# EAGLE schematic Switch (EAGLE 6.1)
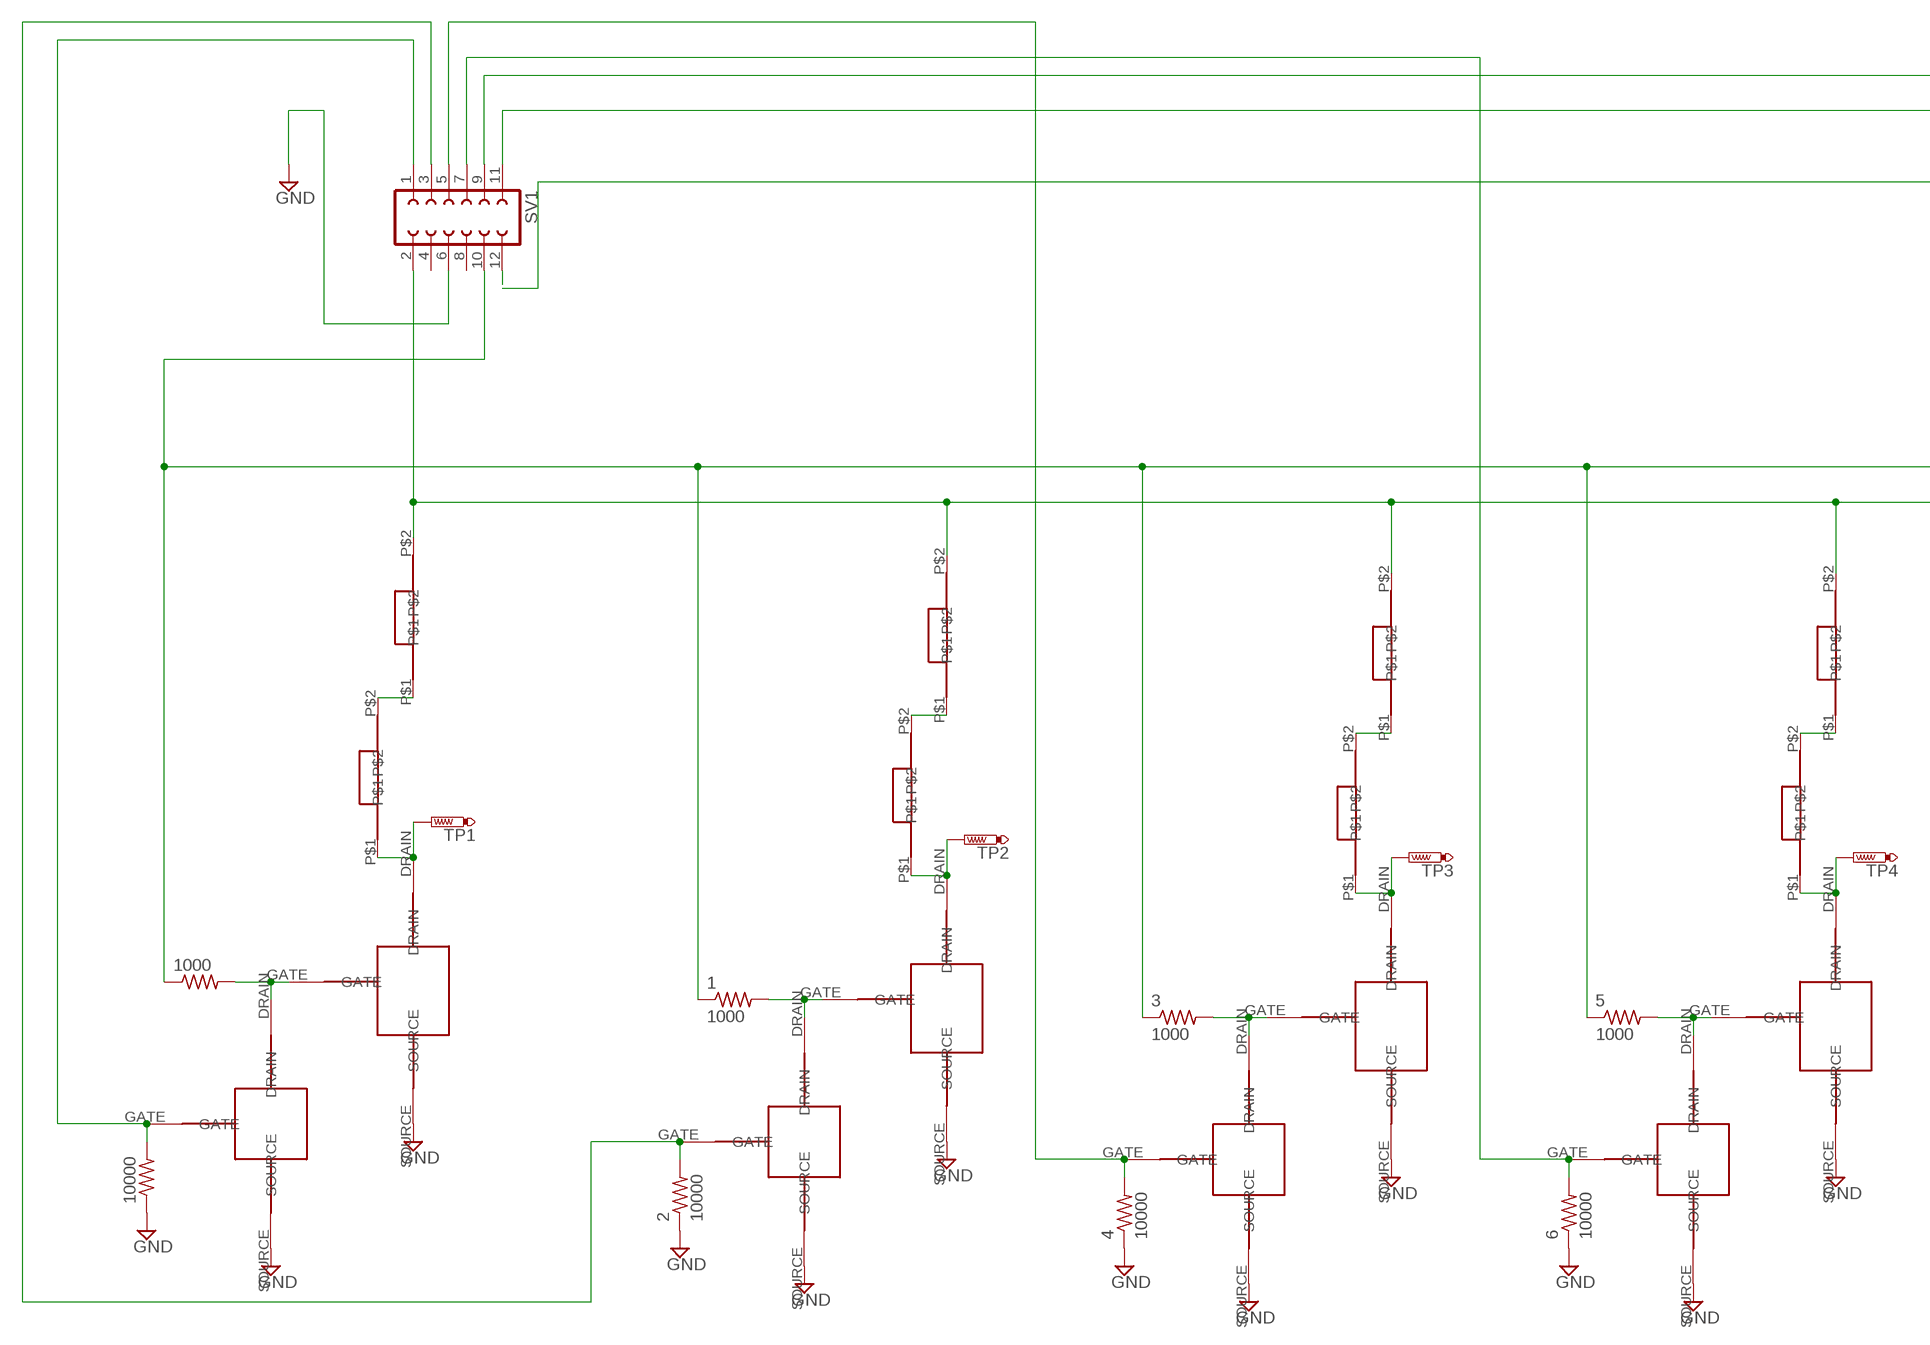
[diagram p0: schematic, sheet 1, part 1 of 2]
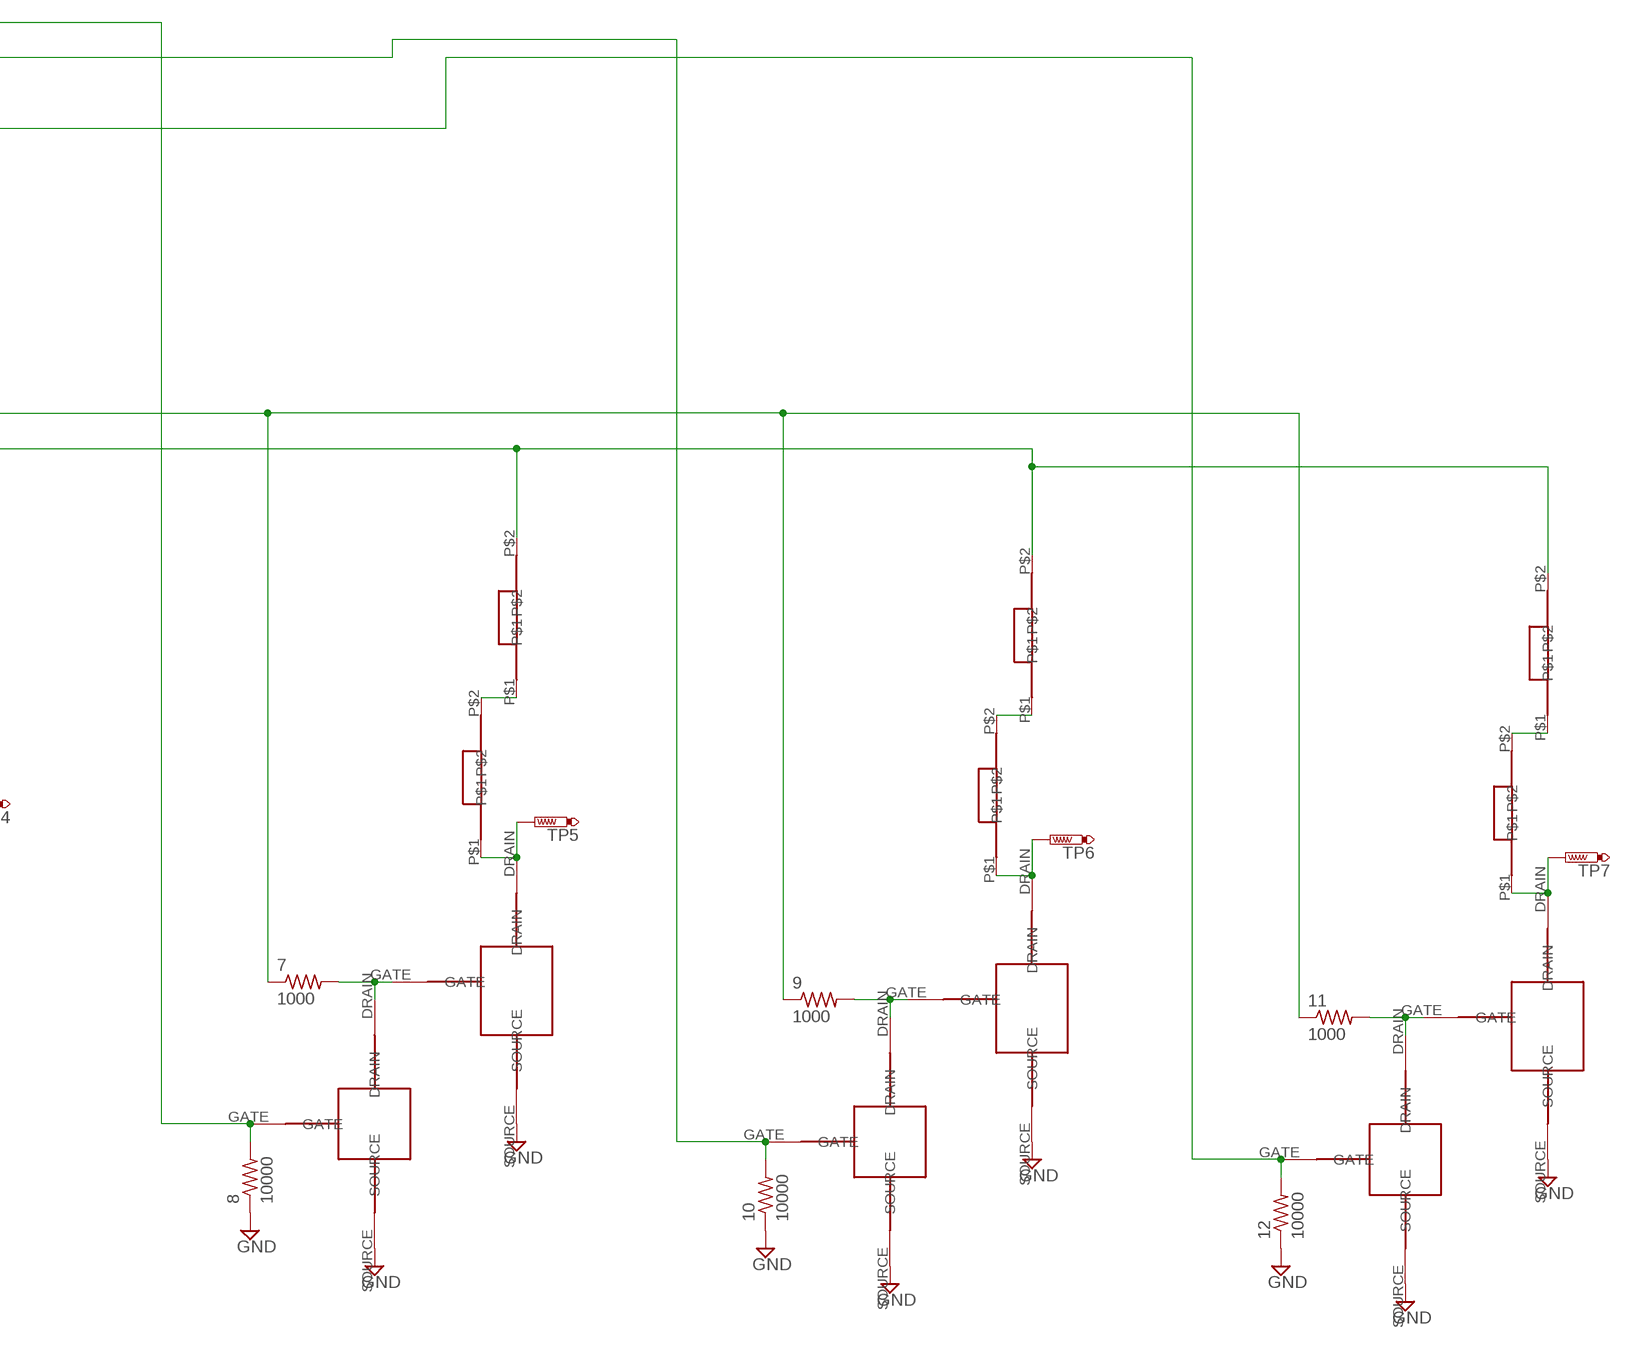
[diagram p1: schematic, sheet 1, part 2 of 2]

## Parts
1  1000  R-US_R0805  [R0805]
2  10000  R-US_R0805  [R0805]
3  1000  R-US_R0805  [R0805]
4  10000  R-US_R0805  [R0805]
5  1000  R-US_R0805  [R0805]
6  10000  R-US_R0805  [R0805]
7  1000  R-US_R0805  [R0805]
8  10000  R-US_R0805  [R0805]
9  1000  R-US_R0805  [R0805]
10  10000  R-US_R0805  [R0805]
11  1000  R-US_R0805  [R0805]
12  10000  R-US_R0805  [R0805]
1000  R-US_R0805  [R0805]
10000  R-US_R0805  [R0805]
SV1  FE06-2  [FE06-2]
TP1  PTR1PAD1-13Y  [P1-13Y]
TP2  PTR1PAD1-13Y  [P1-13Y]
TP3  PTR1PAD1-13Y  [P1-13Y]
TP4  PTR1PAD1-13Y  [P1-13Y]
TP5  PTR1PAD1-13Y  [P1-13Y]
TP6  PTR1PAD1-13Y  [P1-13Y]
TP7  PTR1PAD1-13Y  [P1-13Y]
U$1  FQD2N100  [DPAK]
U$2  2N7000  [TO-92-AMMO]
U$3  FQD2N100  [DPAK]
U$4  2N7000  [TO-92-AMMO]
U$5  SMD_POWER  [SMD_POWER]
U$6  SMD_POWER  [SMD_POWER]
U$7  SMD_POWER  [SMD_POWER]
U$8  SMD_POWER  [SMD_POWER]
U$9  FQD2N100  [DPAK]
U$10  2N7000  [TO-92-AMMO]
U$11  SMD_POWER  [SMD_POWER]
U$12  SMD_POWER  [SMD_POWER]
U$13  FQD2N100  [DPAK]
U$14  2N7000  [TO-92-AMMO]
U$15  SMD_POWER  [SMD_POWER]
U$16  SMD_POWER  [SMD_POWER]
U$17  FQD2N100  [DPAK]
U$18  2N7000  [TO-92-AMMO]
U$19  SMD_POWER  [SMD_POWER]
U$20  SMD_POWER  [SMD_POWER]
U$21  FQD2N100  [DPAK]
U$22  2N7000  [TO-92-AMMO]
U$23  SMD_POWER  [SMD_POWER]
U$24  SMD_POWER  [SMD_POWER]
U$25  FQD2N100  [DPAK]
U$26  2N7000  [TO-92-AMMO]
U$27  SMD_POWER  [SMD_POWER]
U$28  SMD_POWER  [SMD_POWER]

## Nets
GND: 2.1 4.1 6.1 8.1 10.1 12.1 10000.1 SV1.6 U$1.SOURCE U$2.SOURCE U$3.SOURCE U$4.SOURCE U$9.SOURCE U$10.SOURCE U$13.SOURCE U$14.SOURCE U$17.SOURCE U$18.SOURCE U$21.SOURCE U$22.SOURCE U$25.SOURCE U$26.SOURCE
N$1: 1000.2 U$1.GATE U$2.DRAIN
N$2: 10000.2 SV1.1 U$2.GATE
N$3 [Power]: TP1.TP U$1.DRAIN U$5.P$1
N$4 [Power]: U$5.P$2 U$6.P$1
N$5 [Power]: TP2.TP U$3.DRAIN U$7.P$1
N$6 [Power]: SV1.2 U$6.P$2 U$8.P$2 U$12.P$2 U$16.P$2 U$20.P$2 U$24.P$2 U$28.P$2
N$8 [Power]: U$7.P$2 U$8.P$1
N$9: 1.2 U$3.GATE U$4.DRAIN
N$10: 2.2 SV1.3 U$4.GATE
N$11: 8.2 SV1.9 U$18.GATE
N$13 [Power]: TP3.TP U$9.DRAIN U$11.P$1
N$14 [Power]: U$11.P$2 U$12.P$1
N$15: 3.2 U$9.GATE U$10.DRAIN
N$16: 4.2 SV1.5 U$10.GATE
N$17 [Power]: TP4.TP U$13.DRAIN U$15.P$1
N$18 [Power]: U$15.P$2 U$16.P$1
N$19: 5.2 U$13.GATE U$14.DRAIN
N$20: 6.2 SV1.7 U$14.GATE
N$21 [Power]: TP5.TP U$17.DRAIN U$19.P$1
N$22 [Power]: U$19.P$2 U$20.P$1
N$23: 7.2 U$17.GATE U$18.DRAIN
N$24 [Power]: 1.1 3.1 5.1 7.1 9.1 11.1 1000.1 SV1.10
N$25 [Power]: TP6.TP U$21.DRAIN U$23.P$1
N$26 [Power]: U$23.P$2 U$24.P$1
N$27: 9.2 U$21.GATE U$22.DRAIN
N$28: 10.2 SV1.11 U$22.GATE
N$29 [Power]: TP7.TP U$25.DRAIN U$27.P$1
N$30 [Power]: U$27.P$2 U$28.P$1
N$31: 11.2 U$25.GATE U$26.DRAIN
N$32: 12.2 SV1.12 U$26.GATE
Unconnected: SV1.4 SV1.8

## Library data of the parts
1-12 1000 10000 = resistor:R-US_: RESISTOR, American symbol
SV1 = con-lsta:FE06-2: FEMALE HEADER; OC_FARNELL: unknown; OC_NEWARK: unknown
TP1-TP7 = testpad:PTR1: TEST PIN
U$1 U$3 U$9 U$13 U$17 U$21 U$25 = CALEBS:FQD2N100
U$2 U$4 U$10 U$14 U$18 U$22 U$26 = CALEBS:2N7000
U$5-U$8 U$11 U$12 U$15 U$16 U$19 U$20 U$23 U$24 U$27 U$28 = CALEBS:SMD_POWER

## Net classes
1 Power: width 1.27 mm